# EAGLE design Simulador Sensor Hall (EAGLE 9.6.2)
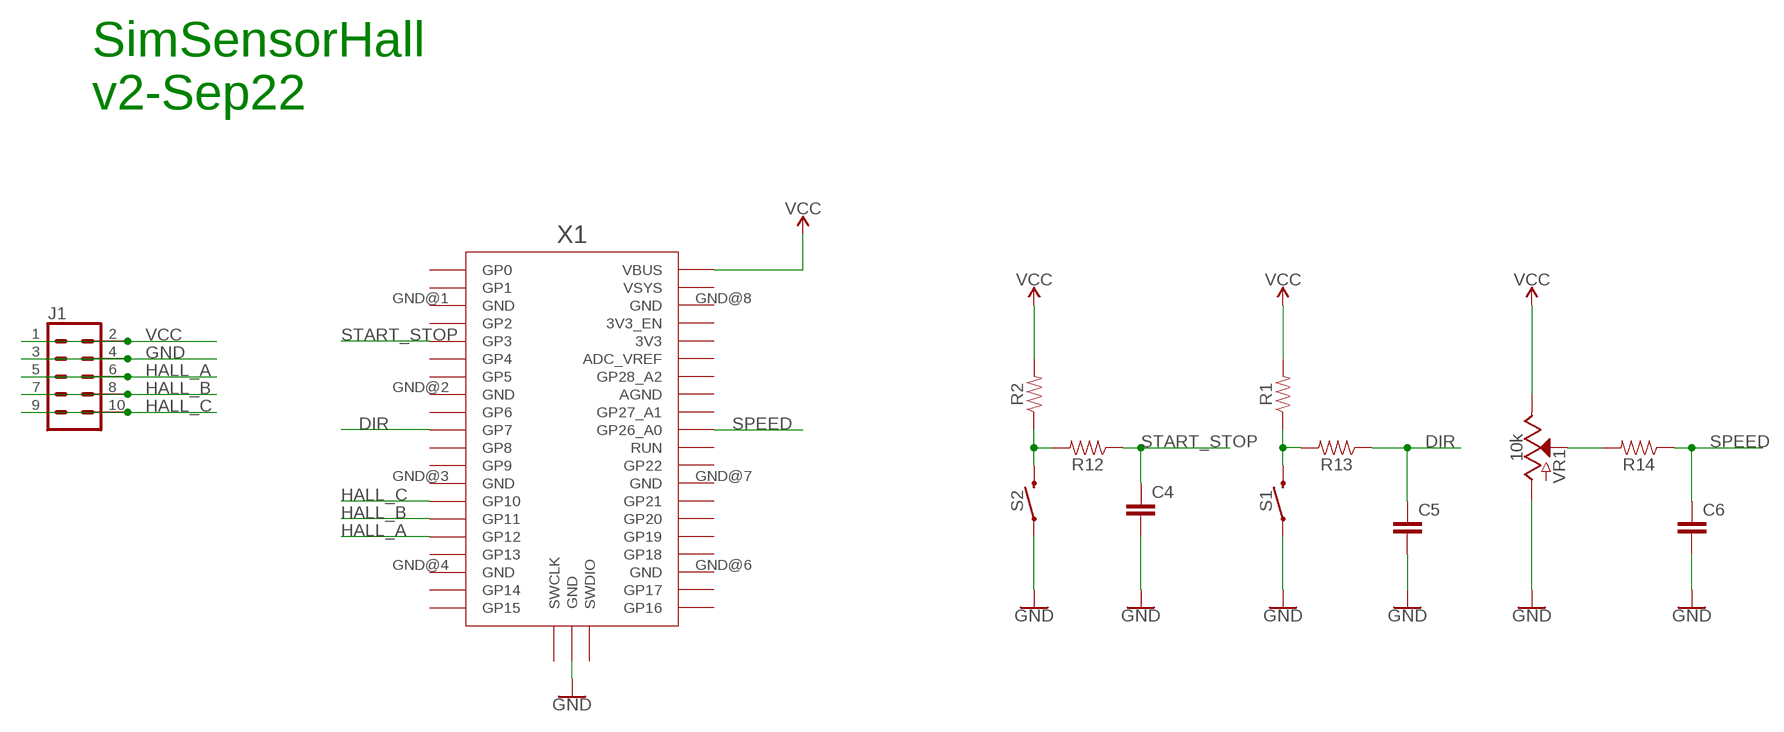
[diagram p0: schematic, sheet 1]

## Parts
C4  C-EUC0805K  [C0805K]
C5  C-EUC0805K  [C0805K]
C6  C-EUC0805K  [C0805K]
J1  CONN_05X2PTH  [2X5]
R1  RESISTOR0805  [0805]
R2  RESISTOR0805  [0805]
R12  RESISTOR0805  [0805]
R13  RESISTOR0805  [0805]
R14  RESISTOR0805  [0805]
S1  MOMENTARY-SWITCH-SPST-SMD-6.2MM-TALL  [TACTILE_SWITCH_SMD_6.2MM_TALL]
S2  MOMENTARY-SWITCH-SPST-SMD-6.2MM-TALL  [TACTILE_SWITCH_SMD_6.2MM_TALL]
VR1  10k  POTENTIOMETER-PTH-9MM-1/20W-20%  [POT-PTH-ALPS]
X1  RPI_PICO_IG-TH  [RPI_PICO_TH]

## Nets
DIR: C5.1 R13.1 X1.GP7
GND: C4.2 C5.2 C6.2 J1.3 J1.4 S1.A2 S2.A2 VR1.P$3(A) X1.GND@5(GND)
HALL_A: J1.5 J1.6 X1.GP12
HALL_B: J1.7 J1.8 X1.GP11
HALL_C: J1.9 J1.10 X1.GP10
N$4: R2.1 R12.2 S2.B2
N$6: R1.1 R13.2 S1.B2
N$8: R14.2 VR1.P$2(S)
SPEED: C6.1 R14.1 X1.GP26_A0
START_STOP: C4.1 R12.1 X1.GP3
VCC: J1.1 J1.2 R1.2 R2.2 VR1.P$1(E) X1.VBUS
Unconnected: X1.3V3 X1.3V3_EN X1.ADC_VREF X1.AGND X1.GND@1(GND) X1.GND@2(GND) X1.GND@3(GND) X1.GND@4(GND) X1.GND@6(GND) X1.GND@7(GND) X1.GND@8(GND) X1.GP0 X1.GP1 X1.GP2 X1.GP4 X1.GP5 X1.GP6 X1.GP8 X1.GP9 X1.GP13 X1.GP14 X1.GP15 X1.GP16 X1.GP17 X1.GP18 X1.GP19 X1.GP20 X1.GP21 X1.GP22 X1.GP27_A1 X1.GP28_A2 X1.RUN X1.SWCLK X1.SWDIO X1.VSYS

## Notes on the sheet
- SimSensorHall
  v2-Sep22

## Library data of the parts
C4-C6 = rcl:C-EU: CAPACITOR, European symbol; SPICEPREFIX: C
J1 = SparkFun-Connectors:CONN_05X2: Multi connection point. Often used as Generic Header-pin footprint for 0.1 inch spaced/style header connections For AVR SPI programming port, see special device with nice symbol: "AVR_SPI_PROG_5x2.dev" You can populate with any combo of single row headers, but if you'd like an exact match, check these: 2x5 AVR ICSP Male Header <https://www.sparkfun.com/products/778> (PRT-00778) 2x5 Pin Shrouded Header <https://www.sparkfun.com/products/8506> (PRT-08506) On any of the 0.1 inch spaced packages, you can populate with these: Break Away Headers - Straight <https://www.sparkfun.com/products/116> (PRT-00116) Break Away Male Headers - Right Angle <https://www.sparkfun.com/products/553> (PRT-00553) Female Headers <https://www.sparkfun.com/products/115> (PRT-00115) Break Away Headers - Machine Pin <https://www.sparkfun.com/products/117> (PRT-00117) Break Away Female Headers - Swiss Machine Pin <https://www.sparkfun.com/products/743> (PRT-00743) Special note: the shrouded connector mates well with our 5x2 ribbon cables: 2x5 Pin IDC Ribbon Cable <https://www.sparkfun.com/products/8535> (PRT-08535); PROD_ID: CONN-08499; SF_ID: PRT-0778
R1 R2 R12-R14 = SparkFun-Resistors:RESISTOR: Generic Resistor Package
S1 S2 = SparkFun-Switches:MOMENTARY-SWITCH-SPST: Momentary Switch (Pushbutton) - SPST Normally-open (NO) SPST momentary switches (buttons, pushbuttons). Variants PTH-12MM - 12mm square, through-hole Momentary Pushbutton Switch - 12mm Square <https://www.sparkfun.com/products/9190> (COM-09190) PTH-6.0MM, PTH-6.0MM-KIT - 6.0mm square, through-hole Mini Pushbutton Switch <https://www.sparkfun.com/products/97> (COM-00097) KIT package intended for soldering kit's - only one side of pads' copper is exposed. PTH-RIGHT-ANGLE-KIT - Right-angle, through-hole Right Angle Tactile Button <https://www.sparkfun.com/products/10791> - Used on SparkFun BigTime Watch Kit <https://www.sparkfun.com/products/11734> SMD-12MM - 12mm square, surface-mount Tactile Button - SMD (12mm) <https://www.sparkfun.com/products/12993> (COM-12993) Used on SparkFun PicoBoard <https://www.sparkfun.com/products/11888> SMD-4.5MM - 4.5mm Square Trackball Switch Used on SparkFun Blackberry Trackballer Breakout <https://www.sparkfun.com/products/13169> SMD-4.6MMX2.8MM - 4.60mm x 2.80mm, surface mount Used on SparkFun SAMD21 Mini Breakout <https://www.sparkfun.com/products/13664> SMD-5.2MM, SMD-5.2-REDUNDANT - 5.2mm square, surface-mount Mini Pushbutton Switch - SMD <https://www.sparkfun.com/products/8720> (COM-08720) Used on Arduino Pro Mini <https://www.sparkfun.com/products/11114> REDUNDANT package connects both switch circuits together SMD-6.0X3.5MM - 6.0 x 3.5mm, surface mount Momentary Reset Switch SMD <https://www.sparkfun.com/products/8229> (COM-08229) SMD-6.2MM-TALL - 6.2mm square, surface mount Tactile Button - SMD (6mm) <https://www.sparkfun.com/products/12992> Used on SparkFun Digital Sandbox <https://www.sparkfun.com/products/12651> SMD-RIGHT-ANGLE - Right-angle, surface mount Used on SparkFun Block for Intel® Edison - Arduino <https://www.sparkfun.com/products/13036>; PROD_ID: SWCH-11966; SF_SKU: COM-12992
VR1 = SparkFun-Resistors:POTENTIOMETER: Potentiometer (Pot) Three-terminal potentiometers, with an adjustable wiper and two adjustable resistors. A pot can be used to create a configurable voltage divider, or as a variable resistor. Variants ALPS_POT and ALPS_POT_KIT - PTH, breadboard compatible, 9mm square pots Rotary Potentiometer - Linear (10k ohm) <https://www.sparkfun.com/products/9288> (COM-09288) The KIT variant exposes copper on only one side of the PTH pad, so the part can only be assembled on one side of the PCB. Useful for beginner soldering kits.; PROD_ID: RES-09177; SF_SKU: COM-09288
X1 = RaspberryPi_Pico:RPI_PICO_IG

## Board
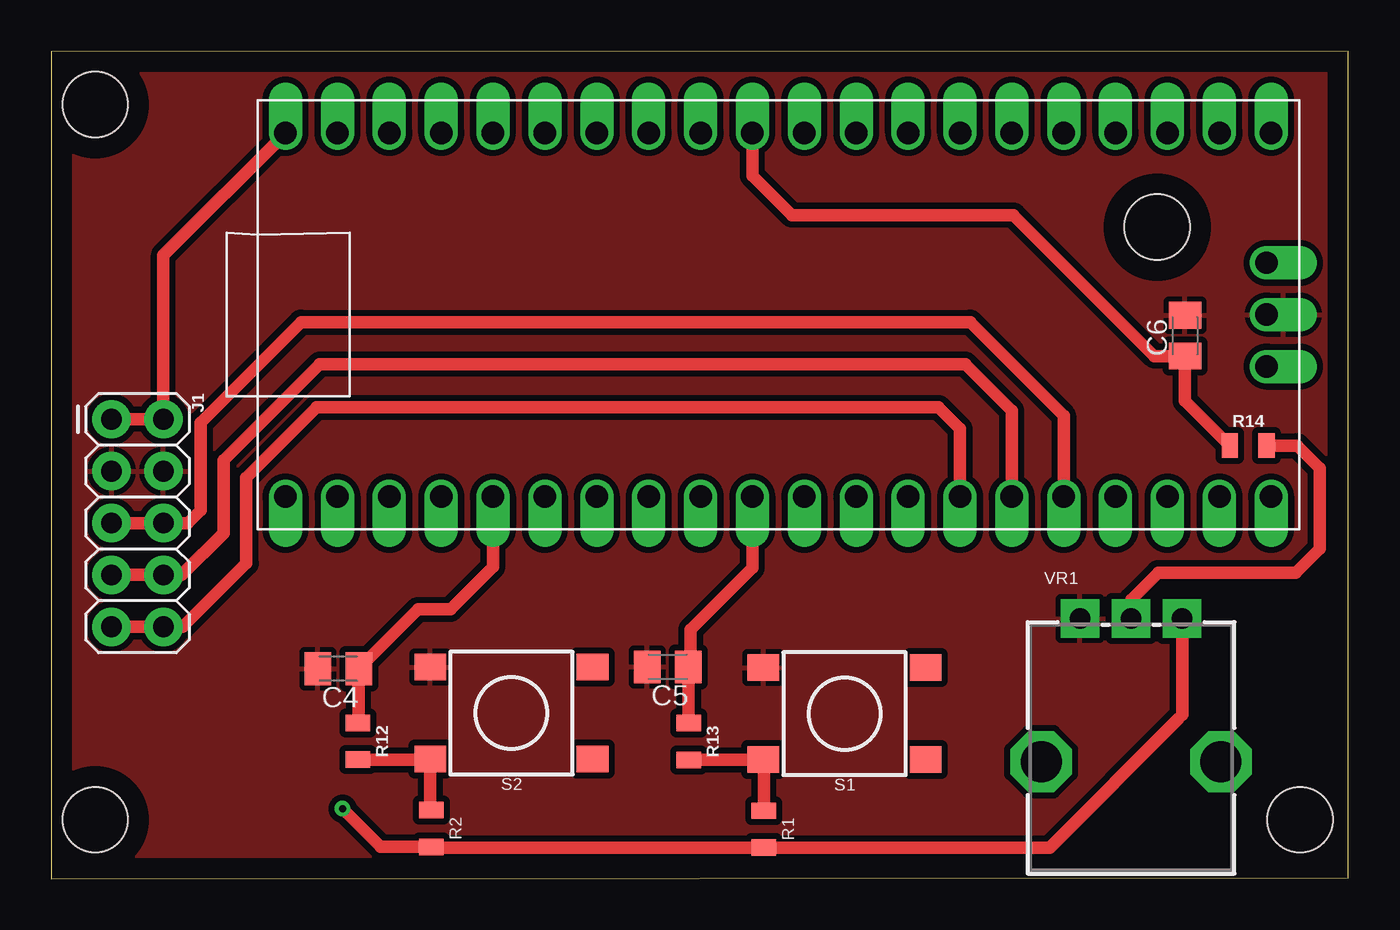
[diagram p1: board, top side]
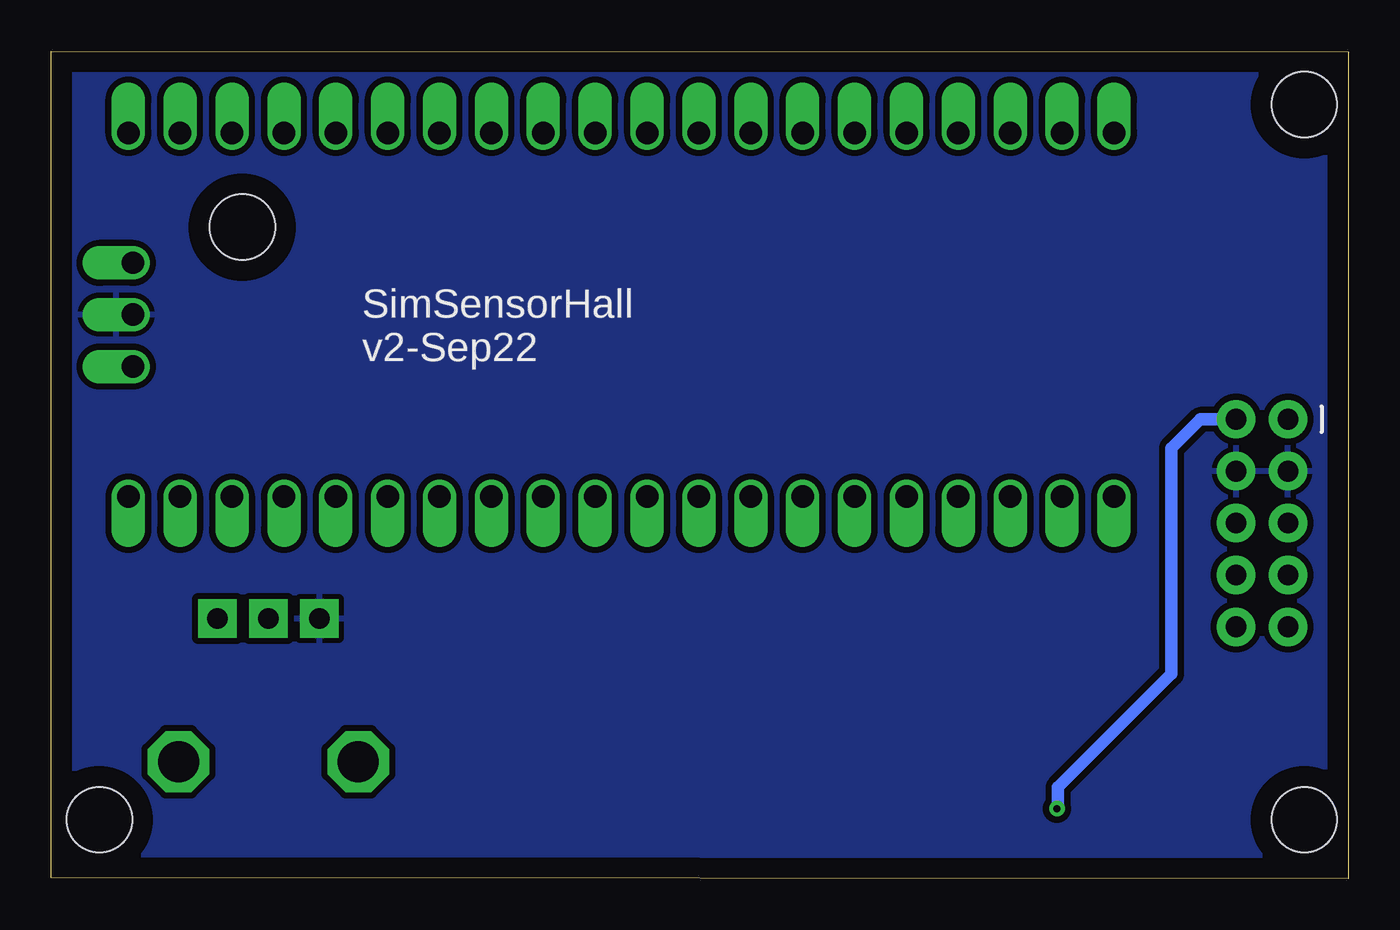
[diagram p2: board, bottom side, seen from below]

Size 63.52 x 40.51 mm. Coordinates in mm from the lower left corner, seen from the top.
Outline: 0.01,0 63.52,0.04 63.51,40.51 0,40.47 0.01,0
Copper layers (1*16): Top 0.035mm / dielectric 1.5mm / Bottom 0.035mm
Design rules "default *": minimum track width 6mil, minimum drill 0.35mm, track to track 12mil, track to pad 12mil, pad to pad 12mil, via to via 12mil, smd to smd 6mil, copper to edge 40mil, drill to drill 6mil, minimum pad ring 10mil, minimum via ring 8mil, stop-mask expansion 4mil, vias tented up to drill 0mil, thermal gap 10mil
Holes 3.2 mm at 2.16,37.89 2.16,2.89 61.16,2.89 54.16,31.89

### Footprints (pad centres in the part's own frame; a part is rotated, then mirrored left to right if it is on the bottom)
C0805K = smd 1.3 x 1.6: 1 -1,0; 2 1,0
2X5 = drill 1.016 pad 1.88: 1 0,0; 2 0,2.54; 3 2.54,0; 4 2.54,2.54; 5 5.08,0; 6 5.08,2.54; 7 7.62,0; 8 7.62,2.54; 9 10.16,0; 10 10.16,2.54
0805 = smd 0.8 x 1.2: 1 -0.9,0; 2 0.9,0
TACTILE_SWITCH_SMD_6.2MM_TALL = smd 1.55 x 1.3: A1 -3.975,-2.25; A2 3.975,-2.25; B1 -3.975,2.25; B2 3.975,2.25
POT-PTH-ALPS = drill 1 pad 1.88 square: P$1 7,-2.5; P$2 7,0; P$3 7,2.5 | drill 2 octagon: P$4 0,-4.4; P$5 0,4.4
RPI_PICO_TH = drill 1.1 pad 1.6 offset: 3V3 8.89,13.97; 3V3_EN 8.89,16.51; ADC_VREF 8.89,11.43; AGND 8.89,6.35; GND@1 -8.89,19.05; GND@2 -8.89,6.35; GND@3 -8.89,-6.35; GND@4 -8.89,-19.05; GND@5 0,-23.9; GND@6 8.89,-19.05; GND@7 8.89,-6.35; GND@8 8.89,19.05; GP0 -8.89,24.13; GP1 -8.89,21.59; GP2 -8.89,16.51; GP3 -8.89,13.97; GP4 -8.89,11.43; GP5 -8.89,8.89; GP6 -8.89,3.81; GP7 -8.89,1.27; GP8 -8.89,-1.27; GP9 -8.89,-3.81; GP10 -8.89,-8.89; GP11 -8.89,-11.43; GP12 -8.89,-13.97; GP13 -8.89,-16.51; GP14 -8.89,-21.59; GP15 -8.89,-24.13; GP16 8.89,-24.13; GP17 8.89,-21.59; GP18 8.89,-16.51; GP19 8.89,-13.97; GP20 8.89,-11.43; GP21 8.89,-8.89; GP22 8.89,-3.81; GP26_A0 8.89,1.27; GP27_A1 8.89,3.81; GP28_A2 8.89,8.89; RUN 8.89,-1.27; SWCLK -2.54,-23.9; SWDIO 2.54,-23.9; VBUS 8.89,24.13; VSYS 8.89,21.59

### Placement (x,y rotation side)
C4  14.06,10.28 180 top
C5  30.19,10.37 180 top
C6  55.52,26.58 90 top
J1  2.96,22.49 270 top
R1  34.9,2.43 270 top
R2  18.62,2.46 270 top
R12  15.02,6.73 270 top
R13  31.21,6.72 270 top
R14  58.61,21.2 0 top
S1  38.85,8.08 180 top
S2  22.54,8.11 180 top
VR1  52.88,5.73 90 top
X1  35.61,27.61 90 top

### Tracks (layer width: path | path; a pad name or v marks a point on that pad's centre or on a via)
DIR
  Top 0.305: 31.21,10.35 C5.1 31.31,10.49
  Top 0.61: 31.21,10.35 R13.1 | 31.31,10.49 31.31,12.19 34.34,15.22 X1.GP7
GND
  pour Top: -1.06,41.36 64.44,41.36 64.44,-1.11 -1.06,-1.23
  pour Bottom: -0.84,41.39 64.66,41.39 64.66,-1.11 -0.84,-1.11
HALL_A
  Top 0.61: J1.5 J1.6 6.69,17.41 7.32,18.04 7.32,22.32 12.24,27.24 45,27.24 49.58,22.66 X1.GP12
HALL_B
  Top 0.61: J1.7 J1.8 6.4,14.87 8.45,16.92 8.45,20.48 13.16,25.19 44.76,25.19 47.04,22.91 X1.GP11
HALL_C
  Top 0.61: J1.9 J1.10 6.45,12.33 9.56,15.44 9.56,19.63 13,23.07 43.45,23.07 44.5,22.02 X1.GP10
N$4
  Top 0.305: 18.54,5.83 S2.B2 | 18.57,3.42 R2.1
  Top 0.61: R12.2 18.54,5.83 | S2.B2 18.57,3.42
N$6
  Top 0.305: S1.B2 34.9,5.78
  Top 0.61: R13.2 S1.B2 | R1.1 34.9,5.78
N$8
  Top 0.61: R14.2 61.01,21.2 62.11,20.1 62.11,16.15 60.95,14.99 54.21,14.99 52.88,13.66 VR1.P$2
SPEED
  Top 0.61: R14.1 55.52,23.39 C6.1 54.02,25.58 47.12,32.48 36.27,32.48 34.34,34.41 X1.GP26_A0
START_STOP
  Top 0.305: R12.1 15.06,7.67
  Top 0.61: X1.GP3 21.64,15.27 19.55,13.18 17.96,13.18 C4.1 15.06,7.67
VCC  (via drill 0.35)
  Top 0.305: R2.2 18.65,1.53 | 55.38,8.02 55.19,7.83
  Top 0.61: X1.VBUS 5.5,30.52 J1.2 J1.1 | v14.27,3.43 16.14,1.56 R2.2 | 18.65,1.53 R1.2 48.89,1.53 55.19,7.83 | 55.38,8.02 VR1.P$1
  Bottom 0.305: 14.22,3.38 v14.27,3.43
  Bottom 0.61: J1.2 7.25,22.49 8.66,21.08 8.66,10.03 14.22,4.47 14.22,3.38

### Text on the board
bPlace: SimSensorHall / v2-Sep22